# EAGLE design uC_Board (EAGLE 7.2.0)
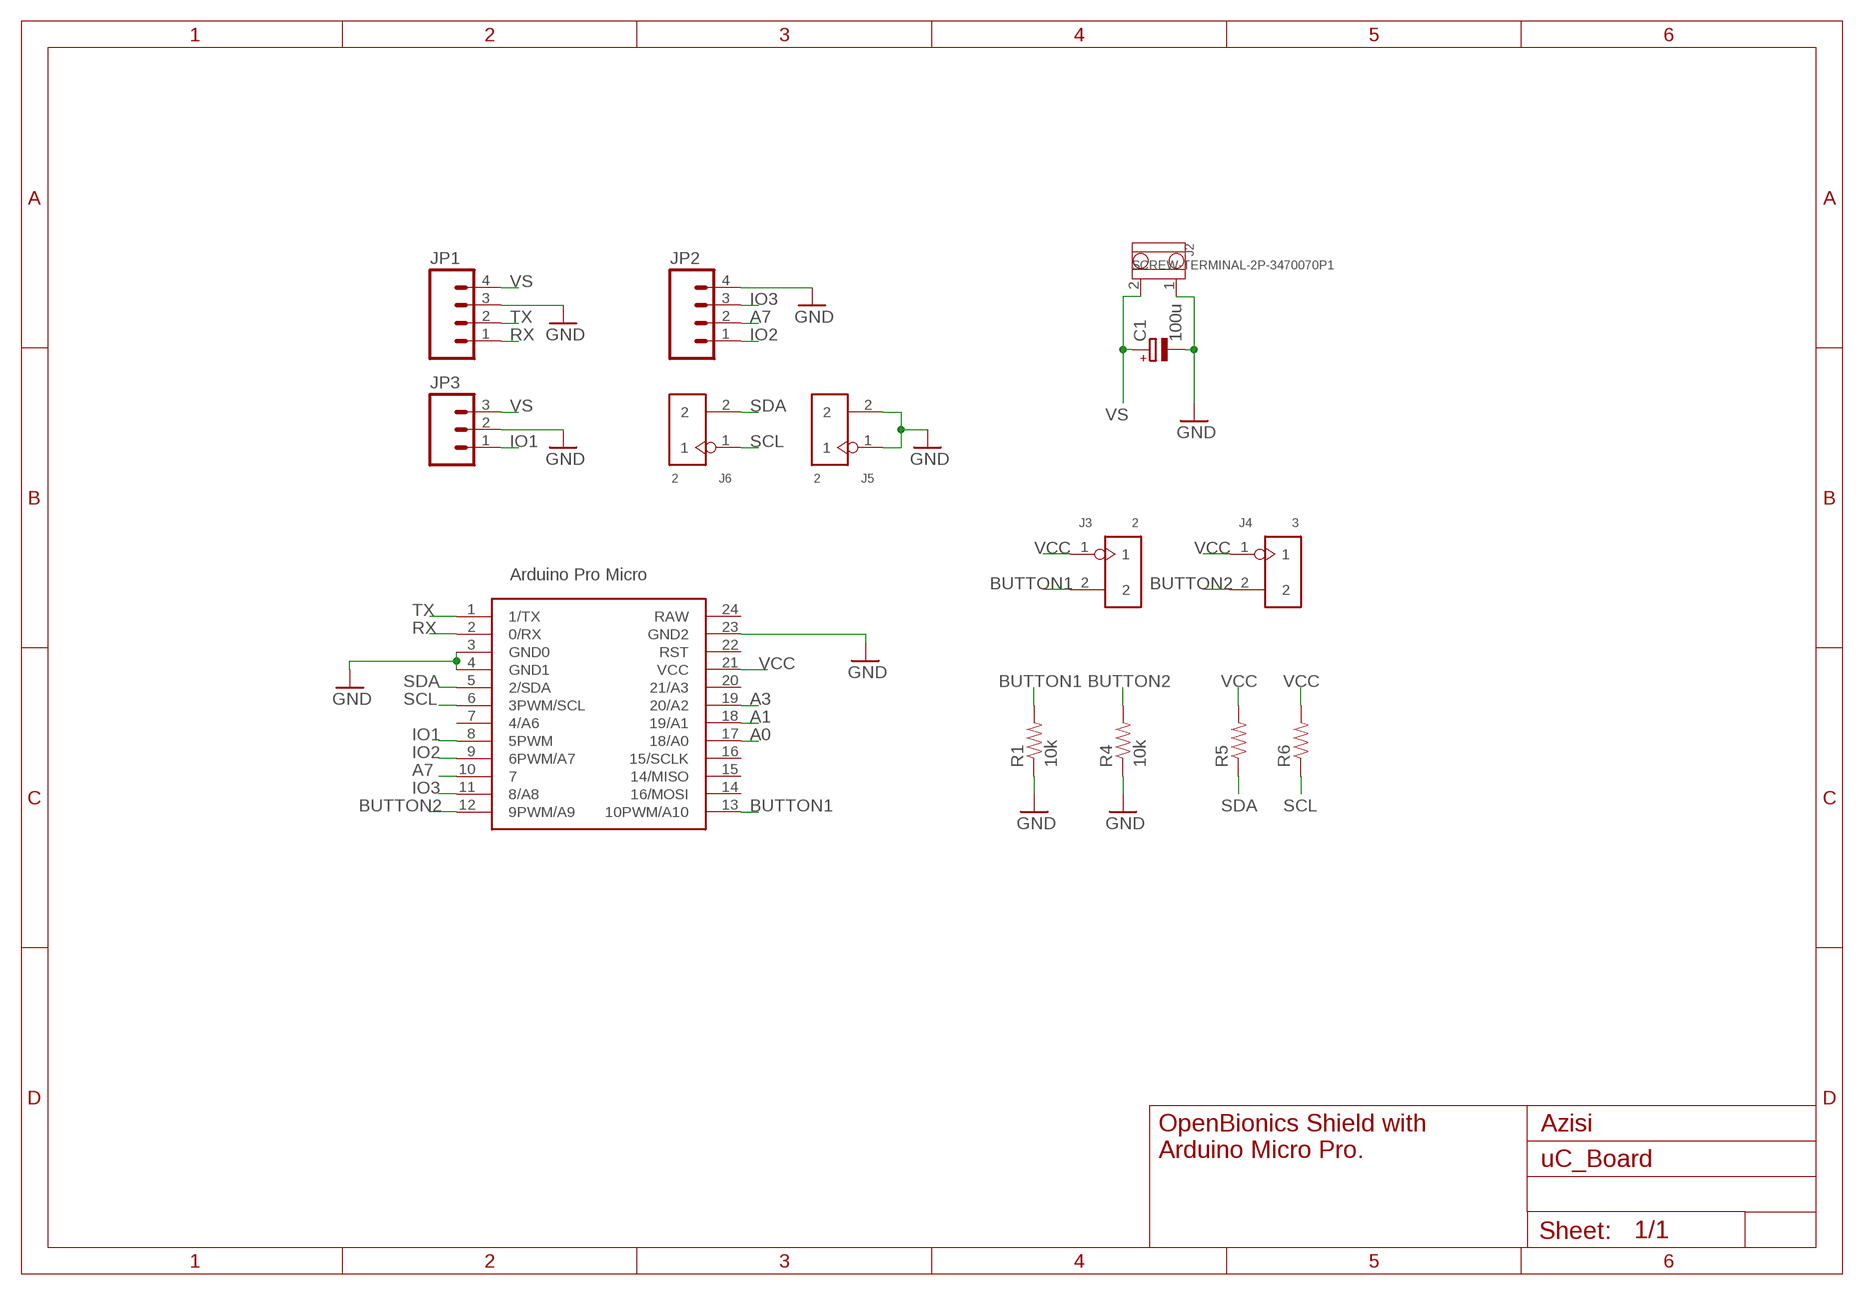
[diagram p0: schematic, sheet 1]

## Parts
ARDUINO_MICRO  ARDUINO_PRO_MICROARDUINO_BOARD  [ARDUINO_MICRO_PRO]
C1  100u  CPOL-EUE2.5-6  [E2,5-6]
J2  SCREW-TERMINAL-2P-3470070P1  [2P-3.5]
J3  2  HEADER-2P-65/35MIL  [2P-2.54-65/35MIL]
J4  3  HEADER-2P-65/35MIL  [2P-2.54-65/35MIL]
J5  2  HEADER-2P-65/35MIL  [2P-2.54-65/35MIL]
J6  2  HEADER-2P-65/35MIL  [2P-2.54-65/35MIL]
JP1  M04PTH  [1X04]
JP2  M04PTH  [1X04]
JP3  M03PTH  [1X03]
R1  10k  RESISTOR0805-RES  [0805]
R4  10k  RESISTOR0805-RES  [0805]
R5  RESISTOR0805-RES  [0805]
R6  RESISTOR0805-RES  [0805]

## Nets
A0: ARDUINO_MICRO.17(18/A0)
A1: ARDUINO_MICRO.18(19/A1)
A3: ARDUINO_MICRO.19(20/A2)
A7: ARDUINO_MICRO.10 JP2.2
BUTTON1: ARDUINO_MICRO.13(10PWM/A10) J3.2 R1.2
BUTTON2: ARDUINO_MICRO.12(9PWM/A9) J4.2 R4.2
GND: ARDUINO_MICRO.3(GND0) ARDUINO_MICRO.4(GND1) ARDUINO_MICRO.23(GND2) C1.- J2.1 J5.1 J5.2 JP1.3 JP2.4 JP3.2 R1.1 R4.1
IO1: ARDUINO_MICRO.8(5PWM) JP3.1
IO2: ARDUINO_MICRO.9(6PWM/A7) JP2.1
IO3: ARDUINO_MICRO.11(8/A8) JP2.3
RX: ARDUINO_MICRO.2(0/RX) JP1.1
SCL: ARDUINO_MICRO.6(3PWM/SCL) J6.1 R6.1
SDA: ARDUINO_MICRO.5(2/SDA) J6.2 R5.1
TX: ARDUINO_MICRO.1(1/TX) JP1.2
VCC: ARDUINO_MICRO.21(VCC) J3.1 J4.1 R5.2 R6.2
VS: C1.+ J2.2 JP1.4 JP3.3
Unconnected: ARDUINO_MICRO.7(4/A6) ARDUINO_MICRO.14(16/MOSI) ARDUINO_MICRO.15(14/MISO) ARDUINO_MICRO.16(15/SCLK) ARDUINO_MICRO.20(21/A3) ARDUINO_MICRO.22(RST) ARDUINO_MICRO.24(RAW)

## Notes on the sheet
- Azisi
- OpenBionics Shield with
  Arduino Micro Pro.

## Library data of the parts
ARDUINO_MICRO = OpenBionics:ARDUINO_PRO_MICRO: Breakout Board for arduino micro pro.
C1 = rcl:CPOL-EU: POLARIZED CAPACITOR, European symbol
J2 = Connector:SCREW-TERMINAL-2P
J3-J6 = Connector:HEADER-2P
JP1 JP2 = SparkFun-Connectors:M04: Header 4 Standard 4-pin 0.1" header. Use with straight break away headers (SKU : PRT-00116), right angle break away headers (PRT-00553), swiss pins (PRT-00743), machine pins (PRT-00117), and female headers (PRT-00115). Molex polarized connector foot print use with SKU : PRT-08231 with associated crimp pins and housings. 1MM SMD Version SKU: PRT-10208
JP3 = SparkFun-Connectors:M03: Header 3 Standard 3-pin 0.1" header. Use with straight break away headers (SKU : PRT-00116), right angle break away headers (PRT-00553), swiss pins (PRT-00743), machine pins (PRT-00117), and female headers (PRT-00115). Molex polarized connector foot print use with SKU : PRT-08232 with associated crimp pins and housings.
R1 R4-R6 = SparkFun-Resistors:RESISTOR: Resistor Basic schematic elements and footprints for 0603, 1206, and PTH resistors.

## Board
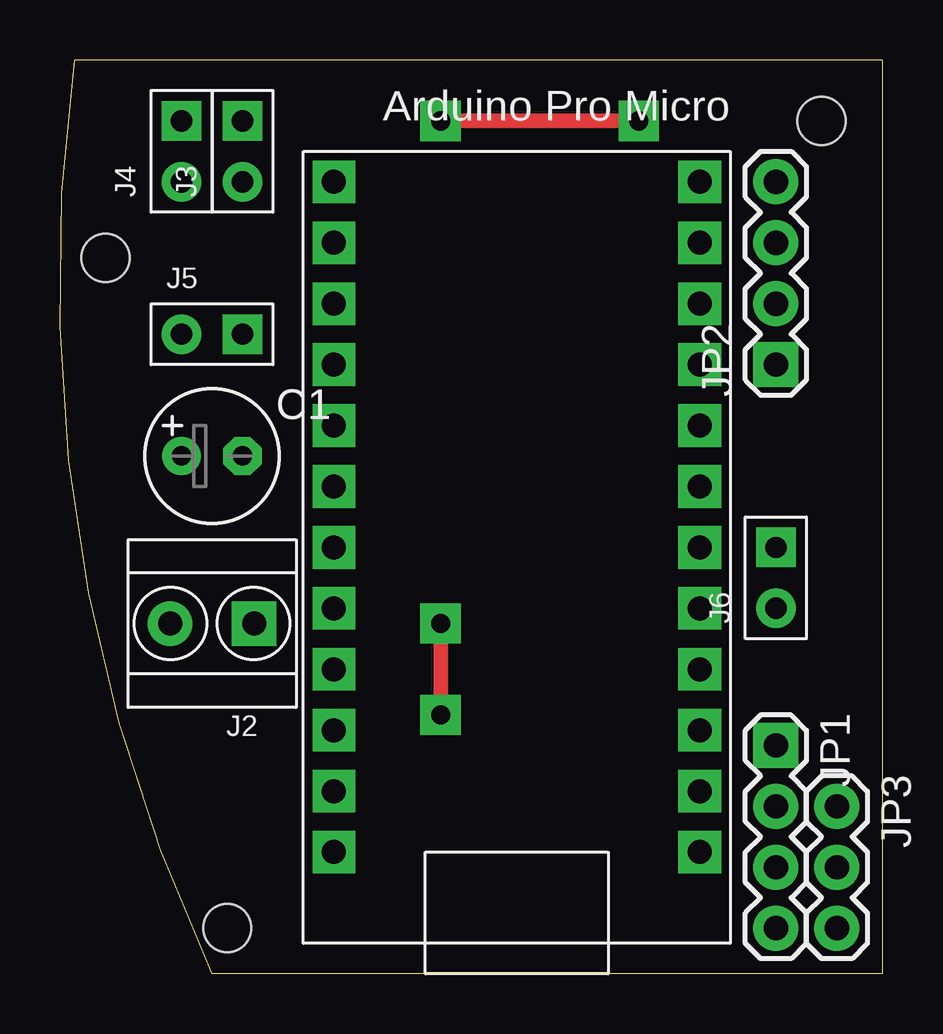
[diagram p1: board, top side]
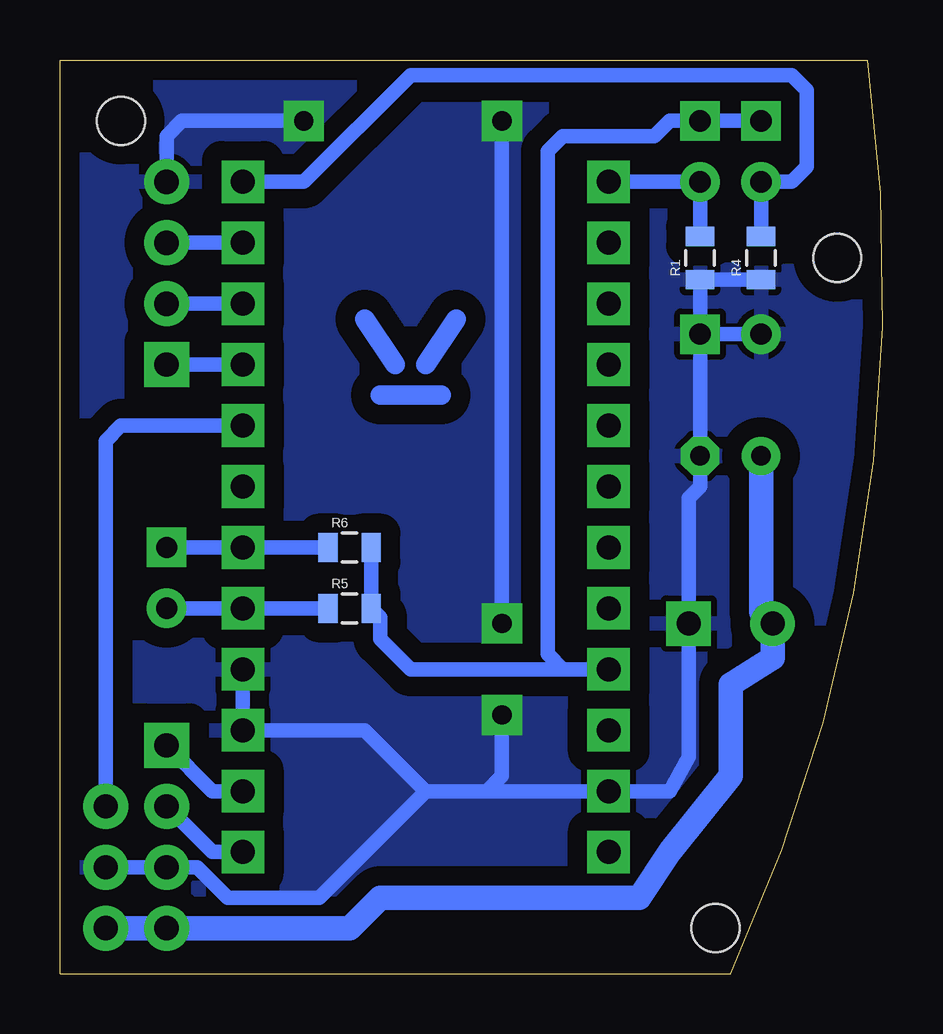
[diagram p2: board, bottom side, seen from below]

Size 34.27 x 38.1 mm. Coordinates in mm from the lower left corner, seen from the top.
Outline: 34.26,38.09 0.62,38.09
Outline: 34.27,38.1 34.27,0 6.33,0 arc-33 0.62,38.1
Copper layers (1*16): Top 0.035mm / dielectric 1.5mm / Bottom 0.035mm
Design rules "SeeedStudio_2layer_DRU_no_angle_20140221": minimum track width 6mil, minimum drill 12mil, track to track 6mil, track to pad 6mil, pad to pad 6mil, via to via 6mil, smd to smd 0mil, copper to edge 10mil, drill to drill 10mil, minimum pad ring 10mil, minimum via ring 6mil, stop-mask expansion 2mil, vias tented up to drill 100mil, thermal gap 10mil
Holes 2 mm at 1.89,29.84 31.73,35.56 6.97,1.91

### Footprints (pad centres in the part's own frame; a part is rotated, then mirrored left to right if it is on the bottom)
ARDUINO_MICRO_PRO = drill 1 pad 1.778 square: 1 -7.62,12.7; 2 -7.62,10.16; 3 -7.62,7.62; 4 -7.62,5.08; 5 -7.62,2.54; 6 -7.62,0; 7 -7.62,-2.54; 8 -7.62,-5.08; 9 -7.62,-7.62; 10 -7.62,-10.16; 11 -7.62,-12.7; 12 -7.62,-15.24; 13 7.62,-15.24; 14 7.62,-12.7; 15 7.62,-10.16; 16 7.62,-7.62; 17 7.62,-5.08; 18 7.62,-2.54; 19 7.62,0; 20 7.62,2.54; 21 7.62,5.08; 22 7.62,7.62; 23 7.62,10.16; 24 7.62,12.7
E2,5-6 = drill 0.813 pad 1.6: + -1.27,0 | drill 0.813 pad 1.6 octagon: - 1.27,0
2P-3.5 = drill 1 pad 1.85 square: 1 -1.75,0 | drill 1 pad 1.85: 2 1.75,0
2P-2.54-65/35MIL = drill 0.889 pad 1.651 square: 1 0,1.27 | drill 0.889 pad 1.651: 2 0,-1.27
1X04 = drill 1.016 pad 1.88 square: 1 0,0 | drill 1.016 pad 1.88: 2 2.54,0; 3 5.08,0; 4 7.62,0
1X03 = drill 1.016 pad 1.88: 1 0,0; 2 2.54,0; 3 5.08,0
0805 = smd 0.8 x 1.2: 1 -0.9,0; 2 0.9,0

### Placement (x,y rotation side)
ARDUINO_MICRO  19.03,17.78 180 top
C1  6.33,21.59 0 top
J2  6.33,14.61 180 top
J3  7.6,34.29 0 top
J4  5.06,34.29 0 top
J5  6.33,26.67 270 top
J6  29.83,16.51 0 top
JP1  29.83,9.53 270 top
JP2  29.83,25.4 90 top
JP3  32.37,6.99 270 top
R1  7.6,29.84 90 bottom
R4  5.06,29.84 90 bottom
R5  22.21,15.24 0 bottom
R6  22.21,17.78 0 bottom

### Tracks (layer width: path | path; a pad name or v marks a point on that pad's centre or on a via)
A7
  Bottom 0.61: ARDUINO_MICRO.10 JP2.2
BUTTON1
  Bottom 0.61: R1.2 J3.2 ARDUINO_MICRO.13
BUTTON2
  Bottom 0.61: R4.2 J4.2 3.79,33.02 3.16,33.66 3.16,36.83 3.79,37.47 19.67,37.47 24.11,33.02 ARDUINO_MICRO.12
GND  (via drill 0.8 pad 1.68)
  Top 0.61: v24.11,35.56 v15.86,35.56 | v15.86,14.61 v15.86,10.79
  Bottom 0.61: 19.03,7.62 21.57,10.16 ARDUINO_MICRO.3 ARDUINO_MICRO.4 | 16.49,7.62 ARDUINO_MICRO.23 8.87,7.62 8.08,9.04 J2.1 8.08,19.84 7.6,20.32 C1.- J5.1 | 19.03,7.62 23.48,3.17 27.29,3.17 28.56,4.45 JP1.3 JP3.2 | R4.1 R1.1 J5.1 | J5.2 J5.1 | v15.86,35.56 v15.86,14.61 | v24.11,35.56 29.19,35.56 29.83,34.92 JP2.4 | 19.03,7.62 16.49,7.62 | 16.49,7.62 15.86,8.26 v15.86,10.79
  pour Bottom (isolate 0.813): 6.33,0 34.27,0 34.27,38.1 0.62,38.1 0.62,16.51
IO1
  Bottom 0.61: ARDUINO_MICRO.8 31.73,22.86 32.37,22.23 JP3.1
IO2
  Bottom 0.61: JP2.1 ARDUINO_MICRO.9
IO3
  Bottom 0.61: ARDUINO_MICRO.11 JP2.3
N$2
  Bottom 0.813: 17.76,27.3 19.03,25.4
N$3
  Bottom 0.813: 20.3,25.4 21.57,27.3
N$5
  Bottom 0.813: 18.4,24.13 20.94,24.13
RX
  Bottom 0.61: ARDUINO_MICRO.2 27.92,7.62 JP1.1
SCL
  Bottom 0.61: R6.1 ARDUINO_MICRO.6 J6.1
SDA
  Bottom 0.61: R5.1 ARDUINO_MICRO.5 J6.2
TX
  Bottom 0.61: ARDUINO_MICRO.1 27.92,5.08 JP1.2
VCC
  Bottom 0.61: R6.2 R5.2 20.94,14.87 20.94,13.97 19.67,12.7 13.32,12.7 | ARDUINO_MICRO.21 13.32,12.7 | J4.1 J3.1 8.87,35.56 9.51,34.92 13.32,34.92 13.95,34.29 13.95,13.34 13.32,12.7
VS
  Bottom 0.61: 4.43,14.76 J2.2
  Bottom 1.016: C1.+ 5.06,15.09 J2.2 4.58,13.18 6.33,12.06 6.33,8.26 8.87,5.08 10.14,3.17 20.94,3.17 22.21,1.91 JP1.4 JP3.3